# EAGLE design SKYROCKET1 (EAGLE 8.3.2)
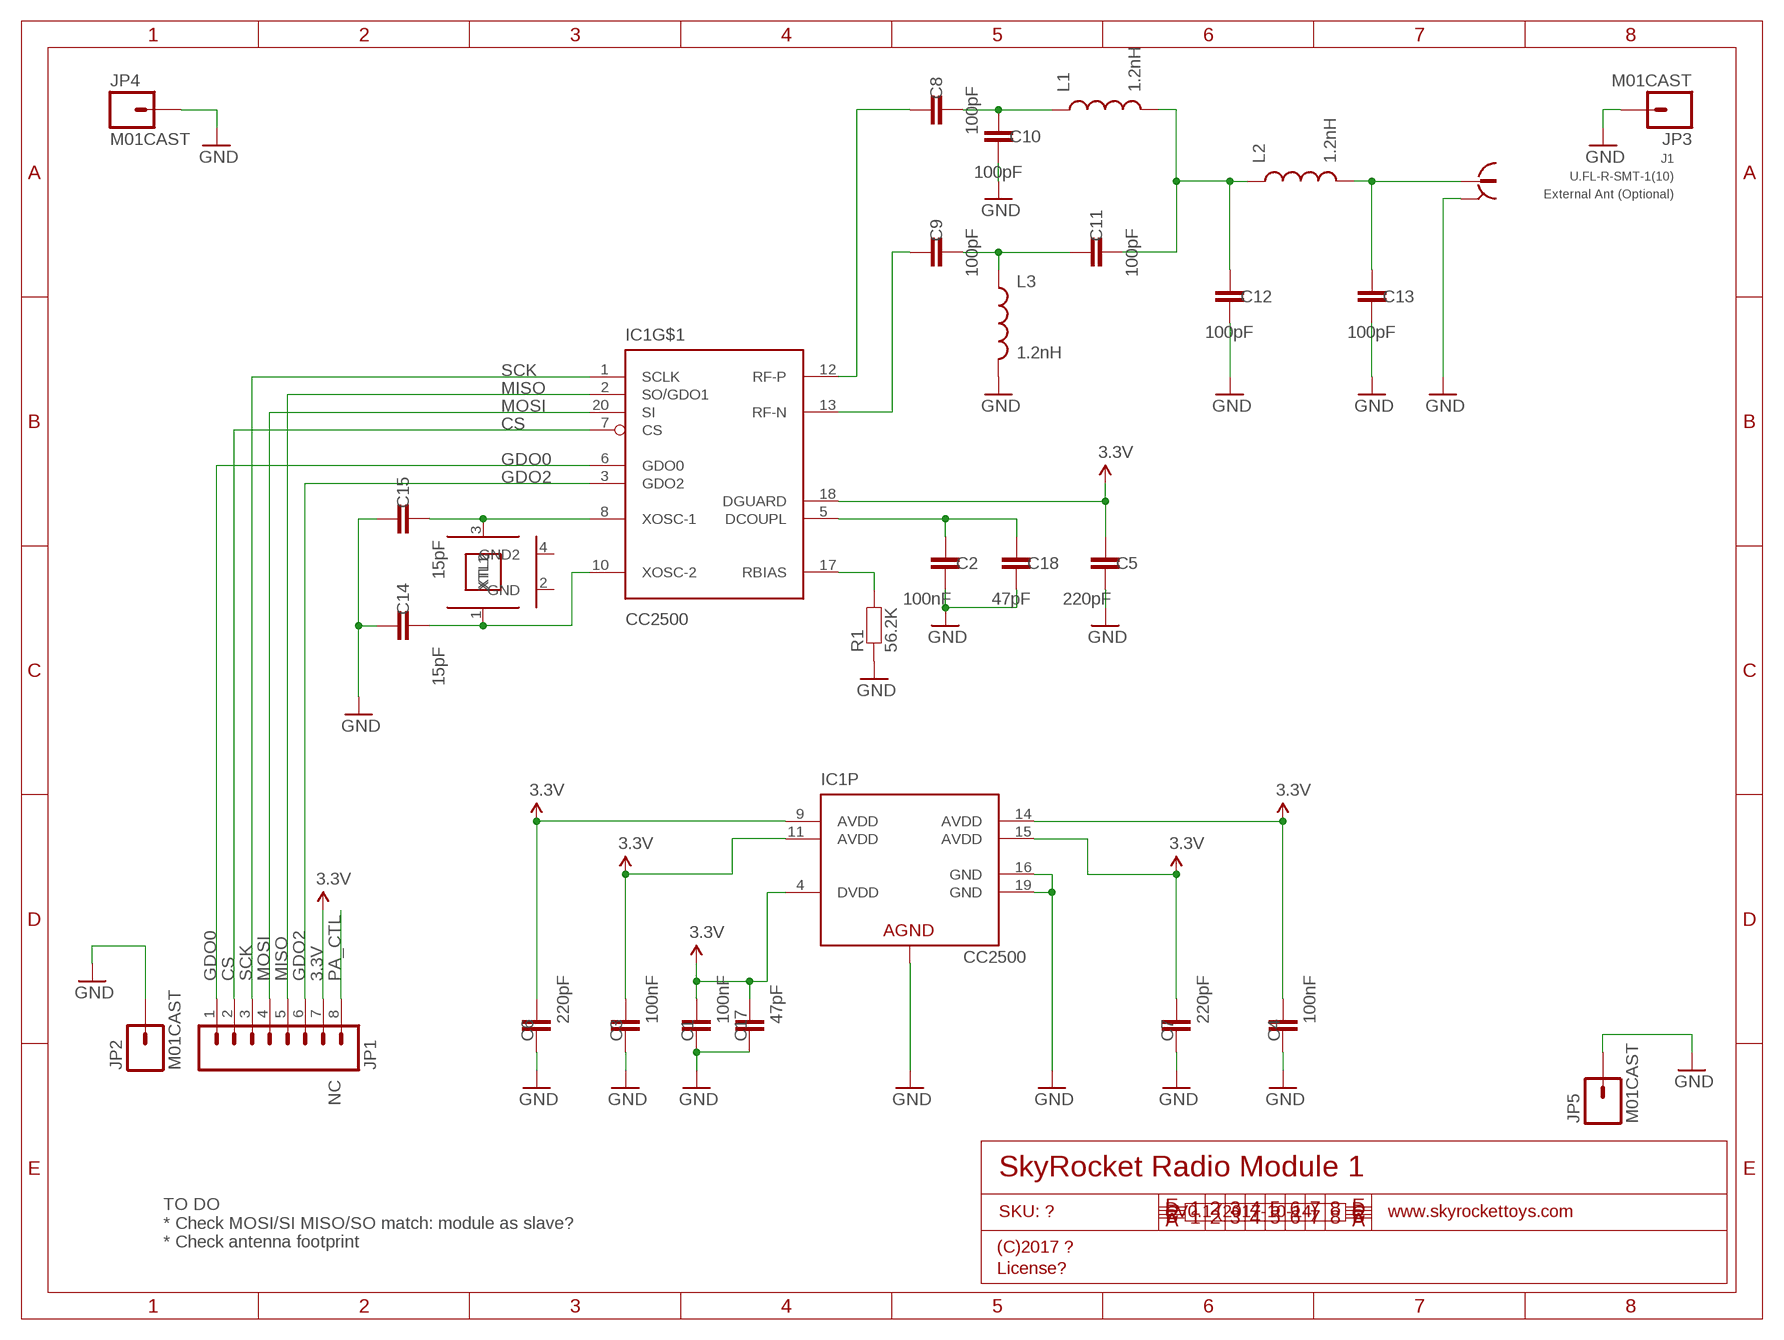
[diagram p0: schematic, sheet 1]

## Parts
C1  100nF  CAP0201  [0201]
C2  100nF  CAP0201  [0201]
C3  100nF  CAP0201  [0201]
C4  100nF  CAP0201  [0201]
C5  220pF  CAP0201  [0201]
C6  220pF  CAP0201  [0201]
C7  220pF  CAP0201  [0201]
C8  100pF  CAP0201  [0201]
C9  100pF  CAP0201  [0201]
C10  100pF  CAP0201  [0201]
C11  100pF  CAP0201  [0201]
C12  100pF  CAP0201  [0201]
C13  100pF  CAP0201  [0201]
C14  15pF  CAP0201  [0201]
C15  15pF  CAP0201  [0201]
C17  47pF  CAP0201  [0201]
C18  47pF  CAP0201  [0201]
IC1  CC2500  [QFN50P400X400X90-21N]
J1  U.FL-R-SMT-1(10)  UFL  [UFL]
JP1  M08CAST  [1X08_CASTELLATED_1.25]
JP2  M01CAST  [1X01_CASTELLATED_1.25]
JP3  M01CAST  [1X01_CASTELLATED_1.25]
JP4  M01CAST  [1X01_CASTELLATED_1.25]
JP5  M01CAST  [1X01_CASTELLATED_1.25]
L1  1.2nH  INDUCTOR20603  [0603]
L2  1.2nH  INDUCTOR20603  [0603]
L3  1.2nH  INDUCTOR20603  [0603]
R1  56.2K  RESISTOR0201  [0201]
XTL1  26MHz  CRYSTAL-GND3X2  [CRYSTAL-SMD-3X2]

## Nets
3.3V: C1.2 C3.2 C4.2 C5.1 C6.2 C7.2 C17.2 IC1.4(P:DVDD) IC1.9(P:AVDD) IC1.11(P:AVDD) IC1.14(P:AVDD) IC1.15(P:AVDD) IC1.18(DGUARD) JP1.7
ANT: C13.1 J1.SIG L2.2
CS: IC1.7(CS) JP1.2
DCOUPL: C2.1 C18.1 IC1.5(DCOUPL)
GDO0: IC1.6(GDO0) JP1.1
GDO2: IC1.3(GDO2) JP1.6
GND: C1.1 C2.2 C3.1 C4.1 C5.2 C6.1 C7.1 C10.2 C12.2 C13.2 C14.1 C15.1 C17.1 C18.2 IC1.16(P:GND) IC1.19(P:GND) IC1.21(P:AGND) J1.GND J1.GND@1(GND) JP2.1 JP3.1 JP4.1 JP5.1 L3.2 R1.1
MISO: IC1.2(SO/GDO1) JP1.5
MOSI: IC1.20(SI) JP1.4
N$1: C8.2 C10.1 L1.1
N$2: C9.2 C11.1 L3.1
N$3: IC1.17(RBIAS) R1.2
N$5: C11.2 C12.1 L1.2 L2.1
N$6: C9.1 IC1.13(RF-N)
N$7: C8.1 IC1.12(RF-P)
N$11: C15.2 IC1.8(XOSC-1) XTL1.3(XTL2)
N$12: C14.2 IC1.10(XOSC-2) XTL1.1(XTL1)
PA_CTL: JP1.8
SCK: IC1.1(SCLK) JP1.3
Unconnected: XTL1.2(GND) XTL1.4(GND2)

## Notes on the sheet
- NC
- SkyRocket Radio Module 1
- SKU: ? | V0.1 (2017-10-14) | www.skyrockettoys.com
- TO DO
  * Check MOSI/SI MISO/SO match: module as slave?
  * Check antenna footprint
- (C)2017 ?
- License?

## Library data of the parts
C1-C15 C17 C18 = freetronics-jon:CAP: Capacitor Standard 0603 ceramic capacitor, and 0.1" leaded capacitor.
IC1 = chipcon-ti-v2:CC2500: Single Chip Low Cost Low Power RF Transceiver frequency band at 2400MHz-2483.5MHz.
J1 = freetronics-luke:UFL: U.FL RF connector; NOTE: External Ant (Optional)
JP1 = freetronics-jon:M08: Header 8 Standard 8-pin 0.1" header. Use with straight break away headers (SKU : PRT-00116), right angle break away headers (PRT-00553), swiss pins (PRT-00743), machine pins (PRT-00117), and female headers (PRT-00115).
JP2-JP5 = freetronics-jon:M01: Header 1 Standard 1-pin 0.1" header. Use with straight break away headers (SKU : PRT-00116), right angle break away headers (PRT-00553), swiss pins (PRT-00743), machine pins (PRT-00117), and female headers (PRT-00115).
L1-L3 = freetronics-jon:INDUCTOR2: Inductors Basic Inductor/Choke - 0603 and 1206. Footprints are not proven and vary greatly between part numbers.
R1 = freetronics-jon:RESISTOR: Resistor Basic schematic elements and footprints for 0603, 1206, and PTH 1/10th watt (small) resistors.
XTL1 = freetronics-jon:CRYSTAL-GND

## Net classes
0 Default: width 0.203 mm
1 VCC: width 0.305 mm

## Board
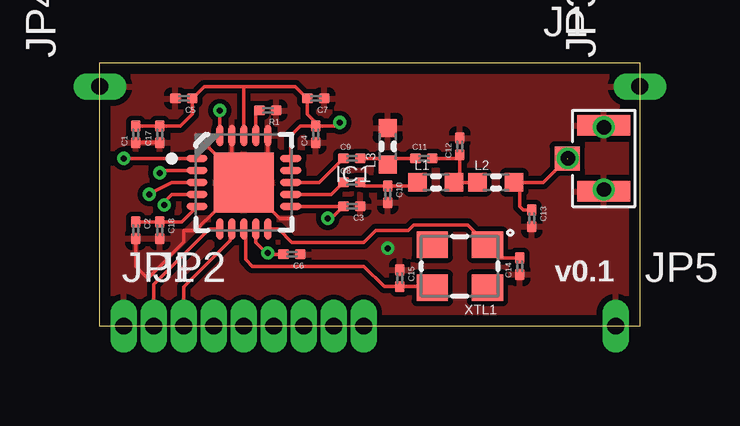
[diagram p1: board, top side]
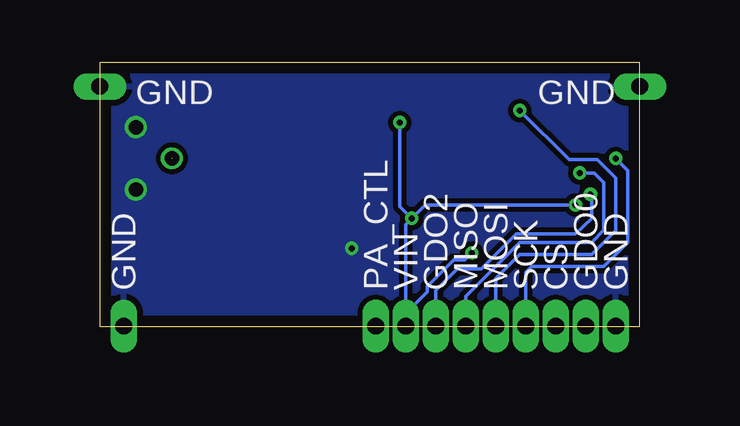
[diagram p2: board, bottom side, seen from below]

Size 22.5 x 11 mm. Coordinates in mm from the lower left corner, seen from the top.
Outline: 22.5,0 0,0 0,11 22.5,11 22.5,0
Copper layers (1*16): Top 0.035mm / dielectric 1.5mm / Bottom 0.035mm
Design rules "default *": minimum track width 8mil, minimum drill 15mil, track to track 8mil, track to pad 8mil, pad to pad 8mil, via to via 8mil, smd to smd 8mil, copper to edge 18mil, drill to drill 8mil, minimum pad ring 8mil, minimum via ring 6mil, stop-mask expansion 4mil, vias tented up to drill 25mil, thermal gap 10mil

### Footprints (pad centres in the part's own frame; a part is rotated, then mirrored left to right if it is on the bottom)
0201 = smd 0.45 x 0.4: 1 -0.35,0; 2 0.35,0
QFN50P400X400X90-21N = smd 0.9 x 0.3: 1 -1.95,1; 2 -1.95,0.5; 3 -1.95,0; 4 -1.95,-0.5; 5 -1.95,-1; 11 1.95,-1; 12 1.95,-0.5; 13 1.95,0; 14 1.95,0.5; 15 1.95,1 | smd 0.3 x 0.9: 6 -1,-1.95; 7 -0.5,-1.95; 8 0,-1.95; 9 0.5,-1.95; 10 1,-1.95; 16 1,1.95; 17 0.5,1.95; 18 0,1.95; 19 -0.5,1.95; 20 -1,1.95 | smd 2.5 x 2.5: 21 0,0
UFL = smd 2.2 x 0.85: GND 0,1.375; GND@1 0,-1.375 | smd 1.05 x 1: SIG -1.525,0
1X08_CASTELLATED_1.25 = drill 0.7 pad 0.9 long: 1 0,0; 2 1.25,0; 3 2.5,0; 4 3.75,0; 5 5,0; 6 6.25,0; 7 7.5,0; 8 8.75,0
1X01_CASTELLATED_1.25 = drill 0.7 pad 0.9 long: 1 0,0
0603 = smd 0.762 x 0.762: 1 -0.762,0; 2 0.762,0
CRYSTAL-SMD-3X2 = smd 1.3 x 1.1: 1 -1.15,-0.9; 2 1.15,-0.9; 3 1.15,0.9; 4 -1.15,0.9

### Placement (x,y rotation side)
C1  1.5,8 90 top
C2  1.5,4 270 top
C3  10.5,5 180 top
C4  9,8 90 top
C5  3.5,9.5 180 top
C6  8,3 180 top
C7  9,9.5 180 top
C8  10.5,6 0 top
C9  10.5,7 0 top
C10  12,5.5 270 top
C11  13.5,7 0 top
C12  15,7.5 90 top
C13  18,4.5 270 top
C14  17.5,2.5 90 top
C15  12.5,2 270 top
C17  2.5,8 90 top
C18  2.5,4 270 top
IC1  6,6 0 top
J1  21,7 0 top
JP1  2.25,0 0 top
JP2  1,0 0 top
JP3  22.5,10 90 top
JP4  0,10 90 top
JP5  21.5,0 0 top
L1  14,6 0 top
L2  16.5,6 0 top
L3  12,7.5 90 top
R1  7,9 180 top
XTL1  15,2.5 180 top

### Tracks (layer width: path | path; a pad name or v marks a point on that pad's centre or on a via)
3.3V  (via drill 0.25)
  Top 0.152: C4.2 8.35,8.35 7.95,7.95 IC1.15 IC1.14 | C4.2 9,8.5 8.65,8.85 C7.2 8.15,10 6,10 | IC1.18 6,10 | C1.2 C17.2 3.35,8.35 3.85,8.85 C5.1 4.35,10 6,10 | IC1.11 C3.2 9.65,4.5 v9.5,4.5 | v10,8.5 9.85,8.35 C4.2 | IC1.4 3,5.5 2.68,5.18 v2.68,5.06 | IC1.9 6.5,3.5 7,3 | 7,3 v7,3.06 | C6.2 7,3
  Bottom 0.152: v9.5,4.5 10,5 v10,8.5 | 9.75,0.53 JP1.7 | 9.75,0.53 9.75,4.25 v9.5,4.5 | v2.68,5.06 8.94,5.06 v9.5,4.5 | v7,3.06 7.3,2.75 7.75,2.75 8.86,1.65 8.86,1.43 9.75,0.53
ANT  (via drill 0.6)  (1 unrouted)
  Top 0.152: J1.SIG 18.48,6 L2.2 17.5,5.76 17.5,5 17.65,4.85 C13.1
  other vias: 19.5,7
CS
  Top 0.152: IC1.7 5.43,3.98 5.43,3.57 3.5,1.64 JP1.2
DCOUPL
  Top 0.152: C2.1 C18.1 3.35,4.35 3.35,4.36 3.41,4.36 IC1.5
GDO0
  Top 0.152: IC1.6 4.55,4.05 2.25,1.75 JP1.1
GDO2  (via drill 0.25)
  Top 0.152: IC1.3 3,6 2,5.5 v2.06,5.5
  Bottom 0.152: v2.06,5.5 2,5.44 2,4.5 2.7,3.86 5.15,3.86 6.61,2.4 7.61,2.4 7.61,2.39 8.5,1.5 JP1.6
GND  (via drill 0.25, 0.6)
  Top 0.152: IC1.19 5.5,6 IC1.21 | IC1.21 7.5,4.5 8,4.5 | C1.1 C17.1 | IC1.21 4,8 | IC1.21 7,7 IC1.16 | IC1.21 4.41,4.41 4.4,4.41 4,4 3.5,4 3.5,3.5 2,2 1.5,2.5 C2.2
  other vias: 12,3.25 21,8.3 21,5.7
  pour Top: 22.5,11 0.04,11 0.04,0 22.5,0
  pour Bottom: 22.5,11 0.04,11 0.04,0 22.5,0
MISO  (via drill 0.25)
  Top 0.152: IC1.2 2.5,6.5 v2.5,6.39
  Bottom 0.152: JP1.5 7.25,1.25 5,3.5 2,3.5 1.5,4 1.5,6 1.89,6.39 v2.5,6.39
MOSI  (via drill 0.25)
  Top 0.152: IC1.20 v5,9
  Bottom 0.152: v5,9 2.95,6.95 1.77,6.95 1,6.18 1,4 2,3 5,3 6,2 JP1.4
N$1
  Top 0.152: L1.1 13.09,5.85 C10.1 11,5.85 C8.2
N$2
  Top 0.152: C11.1 12.26,7 L3.1 11.74,7 C9.2
N$3
  Top 0.152: IC1.17 6.5,8.85 R1.2
N$5
  Top 0.152: L2.1 L1.2 15,6.24 C12.1 14.85,7 C11.2
N$6
  Top 0.152: IC1.13 9.15,6 C9.1
N$7
  Top 0.152: IC1.12 9.65,5.5 C8.1
N$11
  Top 0.152: IC1.8 6.07,3.98 6.07,2.78 6.35,2.5 11,2.5 11.85,1.65 C15.2 13.3,1.65 XTL1.3
N$12
  Top 0.152: C14.2 16.7,2.85 XTL1.1 15.32,4.23 13.08,4.23 12.86,4 11.5,4 11,3.5 8,3.5 7.45,4.05 IC1.10
SCK  (via drill 0.25)
  Top 0.152: IC1.1 2,7 v1,7
  Bottom 0.152: v1,7 0.5,6.5 0.5,3.5 1.5,2.5 4.5,2.5 4.75,2.25 JP1.3

### Text on the board
tPlace: v0.1
bPlace: GND | GND | GND | GDO0 | CS | SCK | MOSI | MISO | GDO2 | VIN | PA_CTL | GND